# Altium schematic sheet Power.SchDoc
size A
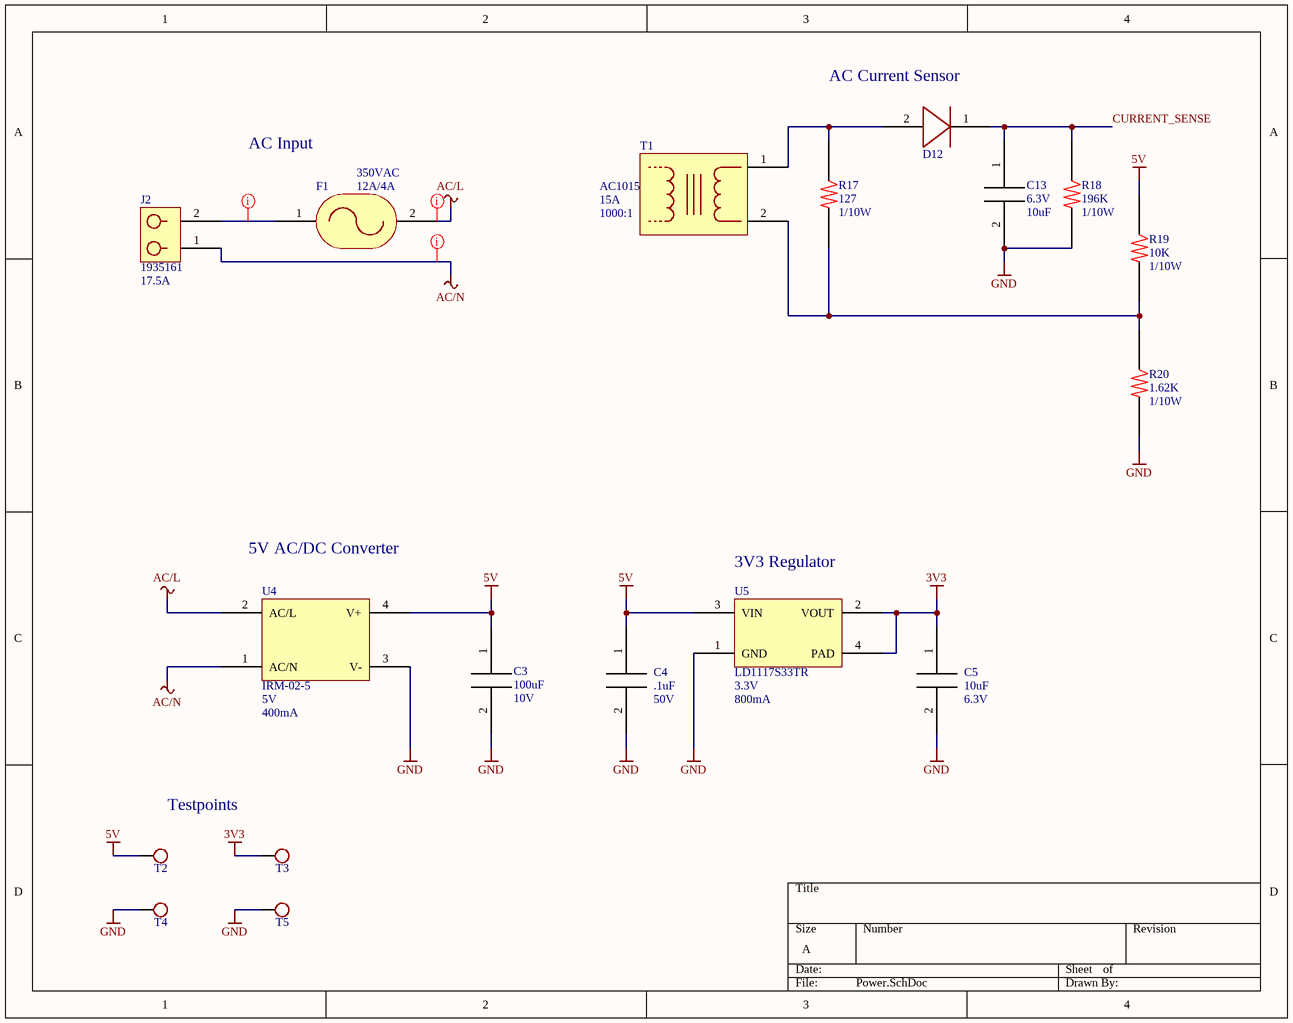
[diagram p0: Power.SchDoc]

## Parts
C3  value 100uF  Rating: 10V  [1210]  (hidden comment: C_CAP_1210)
C4  value .1uF  Rating: 50V  [0603]  (hidden comment: C_CAP_0603)
C5  value 10uF  Rating: 6.3V  [0603]  (hidden comment: C_CAP_0603)
C13  value 10uF  Rating: 6.3V  [0603]  (hidden comment: C_CAP_0603)
D12  D_DIODE_SOD123  [SOD123]  (value not drawn)
F1  value 12A/4A  Rating: 350VAC  [2410]  (hidden comment: F_FUSE_2410)
J2  Rating: 17.5A  [1935161]  (hidden comment: J_2POSTERM_1935161)
R17  value 127  Rating: 1/10W  [0603]  (hidden comment: R_RES_0603)
R18  value 196K  Rating: 1/10W  [0603]  (hidden comment: R_RES_0603)
R19  value 10K  Rating: 1/10W  [0603]  (hidden comment: R_RES_0603)
R20  value 1.62K  Rating: 1/10W  [0603]  (hidden comment: R_RES_0603)
T1  value 1000:1  Rating: 15A  [AC1015]  (hidden comment: T_CURRTRANS_AC1015)
T2  TESTPOINT  [TESTPOINT1MM]  (value not drawn)
T3  TESTPOINT  [TESTPOINT1MM]  (value not drawn)
T4  TESTPOINT  [TESTPOINT1MM]  (value not drawn)
T5  TESTPOINT  [TESTPOINT1MM]  (value not drawn)
U4  value 5V  Rating: 400mA  [IRM-02-5]  (hidden comment: U_IRM-02-5_IRM-02-5)
U5  value 3.3V  Rating: 800mA  PartNumber: LD1117S33TR  [SOT223]  (hidden comment: U_LD1117S33TR_SOT223)

## Nets
3V3: C5.1 T3.1 U5.2(VOUT) U5.4(PAD)
5V: C3.1 C4.1 R19.1 T2.1 U4.4(V+) U5.3(VIN)
AC/L: F1.2 U4.2(AC/L)
AC/N: J2.1 U4.1(AC/N)
GND: C3.2 C4.2 C5.2 C13.2 R18.2 R20.2 T4.1 T5.1 U4.3(V-) U5.1(GND)
CURRENT_SENSE: C13.1 D12.1 R18.1
NetD12_2: D12.2 R17.1 T1.1
NetF1_1: F1.1 J2.2
NetR17_2: R17.2 R19.2 R20.1 T1.2

## Layout directives
rule Width Constraint [Pref Width = 100mil    Min Width = 15mil    Max Width = 250mil]: AC/L, AC/N, NetF1_1

## Notes on the sheet
- (near D12) AC Current Sensor
- AC Input
- 5V AC/DC Converter
- (near U5) 3V3 Regulator
- Testpoints

## Library data of the parts
C3 = C_CAP_1210: PartNumber: GRM32ER61A107ME20L; Manufacturer: Murata
C5 C13 = C_CAP_0603: PartNumber: JMK107ABJ106MA-T; Manufacturer: Taiyo Yuden
D12 = D_DIODE_SOD123: PartNumber: BAS16GWJ; Manufacturer: Nexperia USA Inc; Rating: 215mA
F1 = F_FUSE_2410: PartNumber: 0679H9120-05/0679H4000-05; Manufacturer: Bel Fuse
J2 = J_2POSTERM_1935161: Manufacturer: Phoenix Contact; PartNumber: 1935161
R17 = R_RES_0603: PartNumber: RC0603FR-07127RL; Manufacturer: Yageo
R18 = R_RES_0603: PartNumber: RC0603FR-07196KL; Manufacturer: Yageo
R19 = R_RES_0603: PartNumber: RC0603JR-0710KL; Manufacturer: Yageo
R20 = R_RES_0603: PartNumber: RC0603FR-071K62L; Manufacturer: Yageo
T1 = T_CURRTRANS_AC1015: Manufacturer: Acme Electric/Amveco/Actown; PartNumber: AC1015
T2-T5 = T_TESTPOINT_TESTPOINT1MM: Value: 1mm
U4 = U_IRM-02-5_IRM-02-5: PartNumber: IRM-02-5